# EAGLE design mapleCUx_large_350-005 (EAGLE 9.3.0)
MAPLE-CUx Large Version
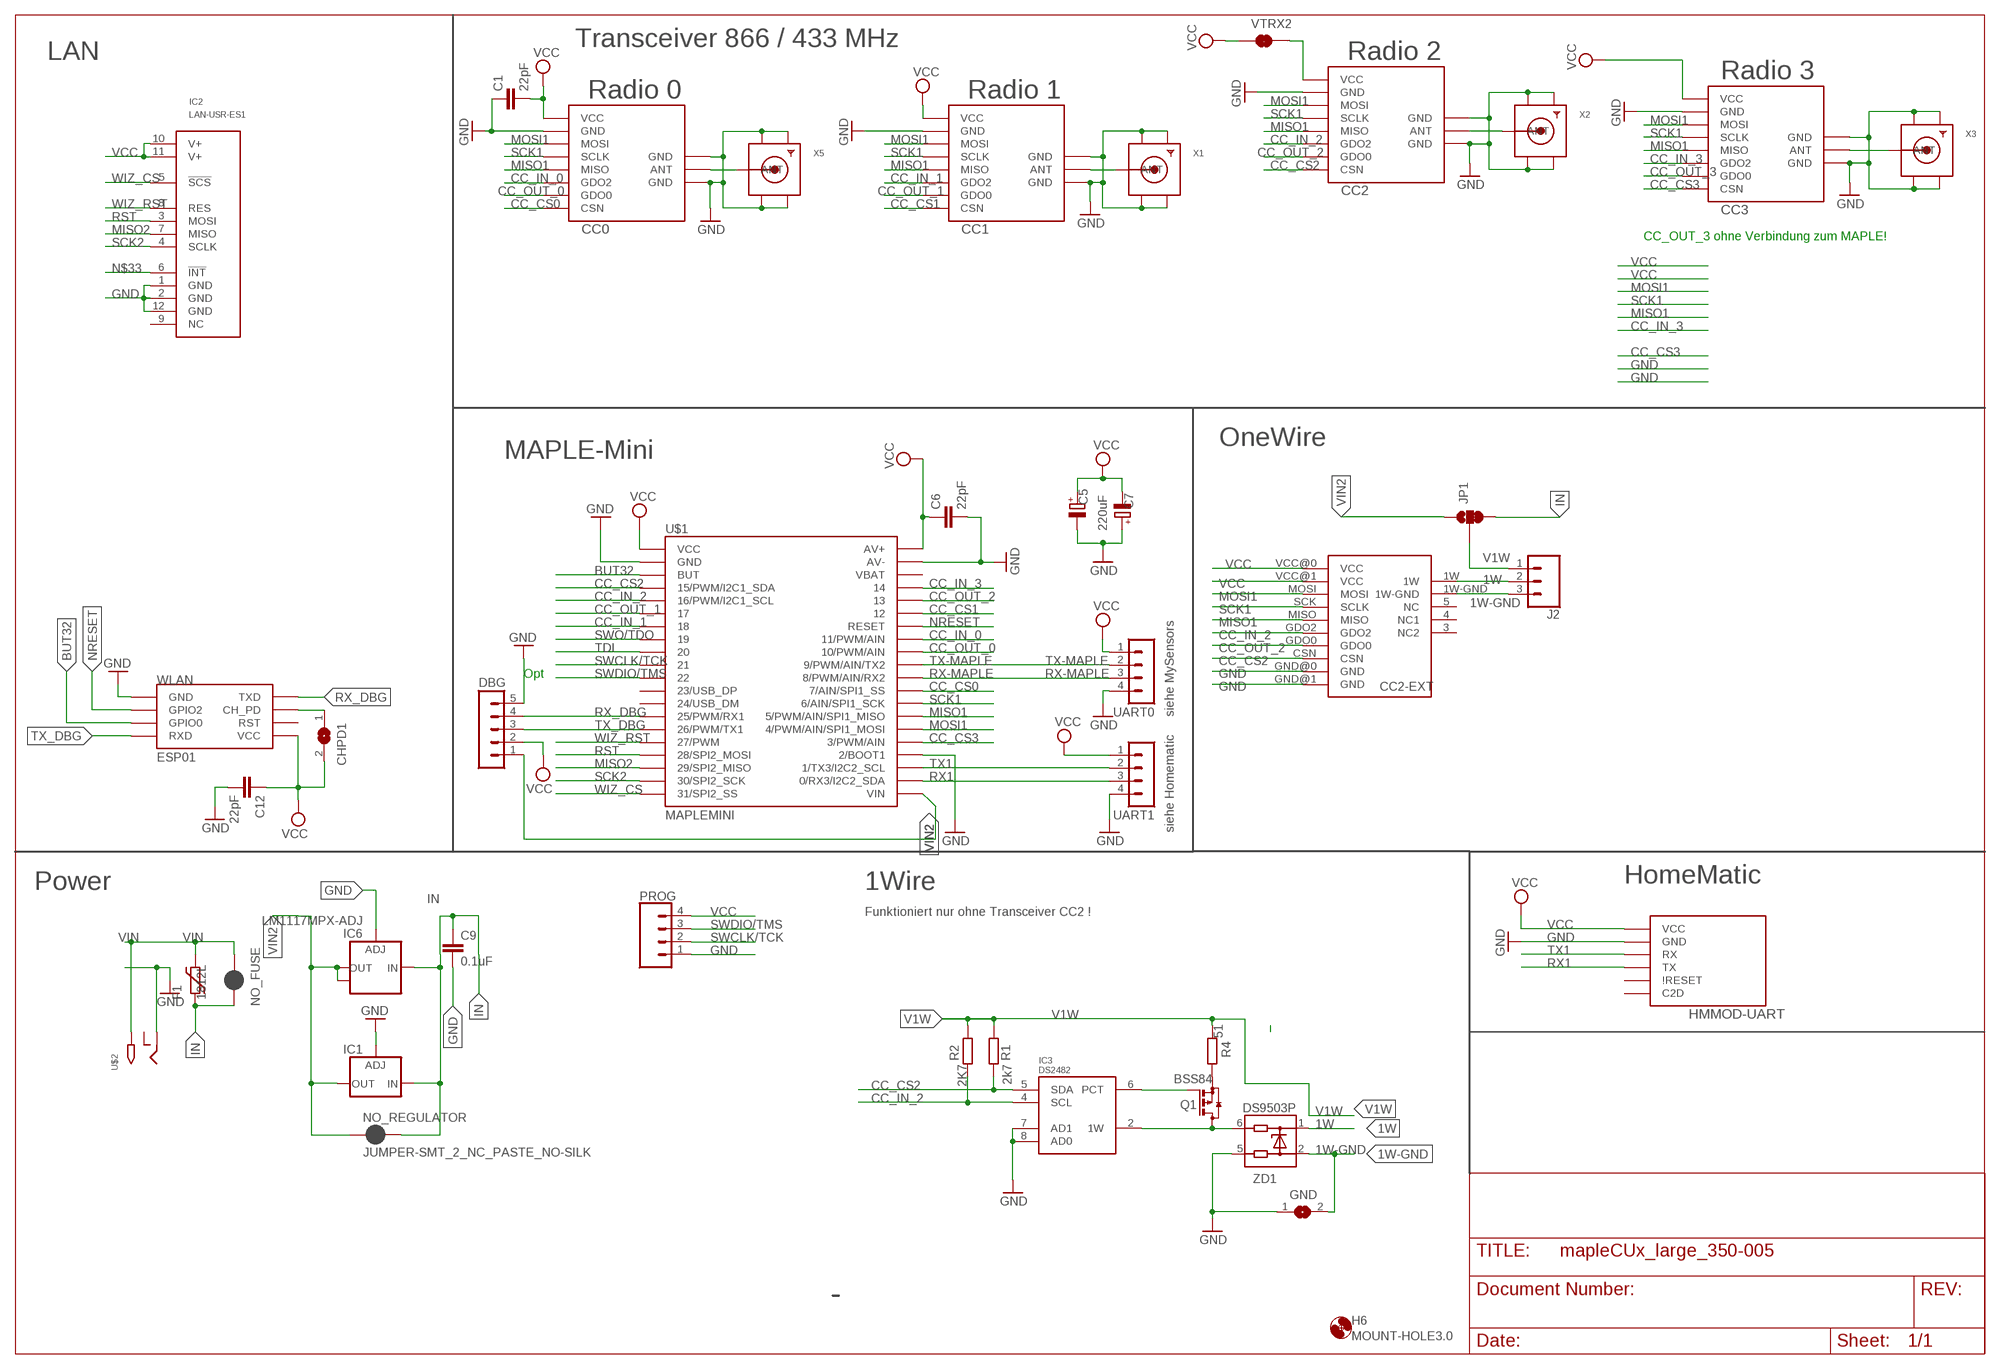
[diagram p0: schematic, sheet 1]

## Parts
C1  22pF  C-EUC0805  [C0805]
C5  220uF  CPOL-EUE5-8.5  [E5-8,5]
C6  22pF  C-EUC0805  [C0805]
C7  CPOL-EUSMCE  [SMC_E]
C9  0.1uF  C-EUC1206  [C1206]
C12  22pF  C-EUC0805  [C0805]
CC0  CC1101  CC1101_MODULE1SMD  [CC1101_MODULE1_SMD]
CC1  CC1101_MODULE1SMD  [CC1101_MODULE1_SMD]
CC2  CC1101_MODULE1SMD  [CC1101_MODULE1_SMD]
CC2-EXT  ONEWIRE-MODULE  [ONEWIRE_CC1101_MODULE3_DIL]
CC3  CC1101_MODULE1SMD  [CC1101_MODULE1_SMD]
CHPD1  SJ  [SJ]
DBG  MA05-1  [MA05-1]
F1  1812L  [1812L]
GND  SJ  [SJ]
H6  MOUNT-HOLE3.0  [3,0]
HMMOD-UART  HM-MOD-UARTDIL  [HM-MOD-UART-DIL]
IC1  LD117ADT50TR  [DPACK]
IC2  LAN-USR-ES1  [USR-ES1]
IC3  DS2482  DS2482-100S  [SO08]
IC6  LM1117MPX-ADJ  [SOT223]
J2  CONN_03LONGPADS  [1X03_LONGPADS]
JP1  JUMPER-SMT_3_1-NC_TRACE_SILK  [SMT-JUMPER_3_1-NC_TRACE_SILK]
NO_FUSE  JUMPER-SMT_2_NC_PASTE_NO-SILK  [SMT-JUMPER_2_NC_PASTE_NO-SILK]
NO_REGULATOR  JUMPER-SMT_2_NC_PASTE_NO-SILK  [SMT-JUMPER_2_NC_PASTE_NO-SILK]
PROG  CONN_04LOCK  [1X04_LOCK]
Q1  BSS84  [SOT23]
R1  2k7  R-EU_R0805  [R0805]
R2  2K7  R-EU_R0805  [R0805]
R4  51  R-EU_R0805  [R0805]
U$1  MAPLEMINI  [20-DIP]
U$2  2.1MMJACKTHM  [PJ-102A]
UART0  MA04-1  [MA04-1]
UART1  MA04-1  [MA04-1]
VTRX2  JUMPER-SMT_2_NC_TRACE_SILK  [SMT-JUMPER_2_NC_TRACE_SILK]
WLAN  ESP01  [ESP01]
X1  SMACONNECTOR_EDGE  [SMA_EDGELAUNCH]
X2  SMACONNECTOR_EDGE  [SMA_EDGELAUNCH]
X3  SMACONNECTOR_EDGE  [SMA_EDGELAUNCH]
X5  SMACONNECTOR_EDGE  [SMA_EDGELAUNCH]
ZD1  DS9503P  [TSOC6]

## Nets
1W: CC2-EXT.1W J2.2 ZD1.1
1W-GND: CC2-EXT.1W-GND GND.2 J2.3 ZD1.2
ANT0: CC0.ANT X5.P(ANT)
ANT1: CC1.ANT X1.P(ANT)
ANT2: CC2.ANT X2.P(ANT)
ANT3: CC3.ANT X3.P(ANT)
BUT32: U$1.3(BUT) WLAN.GPIO0
CC_CS0: CC0.CSN U$1.29(7/AIN/SPI1_SS)
CC_CS1: CC1.CSN U$1.35
CC_CS2: CC2-EXT.CSN CC2.CSN IC3.5(SDA) R1.2 U$1.4(15/PWM/I2C1_SDA)
CC_CS3: CC3.CSN U$1.25(3/PWM/AIN)
CC_IN_0: CC0.GDO2 U$1.33(11/PWM/AIN)
CC_IN_1: CC1.GDO2 U$1.7
CC_IN_2: CC2-EXT.GDO2 CC2.GDO2 IC3.4(SCL) R2.2 U$1.5(16/PWM/I2C1_SCL)
CC_IN_3: CC3.GDO2 U$1.37
CC_OUT_0: CC0.GDO0 U$1.32(10/PWM/AIN)
CC_OUT_1: CC1.GDO0 U$1.6
CC_OUT_2: CC2-EXT.GDO0 CC2.GDO0 U$1.36
CC_OUT_3: CC3.GDO0
GND [Power]: C1.1 C5.- C6.2 C7.+ C9.2 C12.2 CC0.GND@0(GND) CC0.GND@1(GND) CC0.GND@2(GND) CC1.GND@0(GND) CC1.GND@1(GND) CC1.GND@2(GND) CC2-EXT.GND@0(GND) CC2-EXT.GND@1(GND) CC2.GND@0(GND) CC2.GND@1(GND) CC2.GND@2(GND) CC3.GND@0(GND) CC3.GND@1(GND) CC3.GND@2(GND) DBG.5 GND.1 HMMOD-UART.2(GND) IC1.1(ADJ) IC2.1(GND) IC2.2(GND) IC2.12(GND) IC3.7(AD1) IC3.8(AD0) IC6.1(ADJ) PROG.1 U$1.2(GND) U$1.24(2/BOOT1) U$1.39(AV-) U$2.RING UART0.4 UART1.4 WLAN.GND X1.GND@1(GND4) X1.GND@2(GND3) X1.GND@3(GND2) X1.GND@4(GND1) X2.GND@1(GND4) X2.GND@2(GND3) X2.GND@3(GND2) X2.GND@4(GND1) X3.GND@1(GND4) X3.GND@2(GND3) X3.GND@3(GND2) X3.GND@4(GND1) X5.GND@1(GND4) X5.GND@2(GND3) X5.GND@3(GND2) X5.GND@4(GND1) ZD1.5
IN [Power]: C9.1 F1.P$1 IC1.3(IN) IC6.3(IN) JP1.3 NO_FUSE.1 NO_REGULATOR.2
MISO1: CC0.MISO CC1.MISO CC2-EXT.MISO CC2.MISO CC3.MISO U$1.27(5/PWM/AIN/SPI1_MISO)
MISO2: IC2.7(MISO) U$1.18(29/SPI2_MISO)
MOSI1: CC0.MOSI CC1.MOSI CC2-EXT.MOSI CC2.MOSI CC3.MOSI U$1.26(4/PWM/AIN/SPI1_MOSI)
N$1 [Power]: CC2.VCC VTRX2.2
N$2: CHPD1.1 WLAN.CH_PD
N$33: IC2.6(!INT!)
N$47: IC3.6(PCT) Q1.1(G)
N$48: IC3.2(1W) Q1.3(D) ZD1.6
N$52: Q1.2(S) R4.1
NRESET: U$1.34(RESET) WLAN.GPIO2
RST: IC2.3(MOSI) U$1.17(28/SPI2_MOSI)
RX1: HMMOD-UART.5(TX) U$1.22(0/RX3/I2C2_SDA) UART1.3
RX-MAPLE: U$1.30(8/PWM/AIN/RX2) UART0.3
RX_DBG: DBG.4 U$1.14(25/PWM/RX1) WLAN.TX(TXD)
SCK1: CC0.SCLK CC1.SCLK CC2-EXT.SCK(SCLK) CC2.SCLK CC3.SCLK U$1.28(6/AIN/SPI1_SCK)
SCK2: IC2.4(SCLK) U$1.19(30/SPI2_SCK)
SWCLK/TCK: PROG.2 U$1.10
SWDIO/TMS: PROG.3 U$1.11
SWO/TDO: U$1.8
TDI: U$1.9
TX1: HMMOD-UART.6(RX) U$1.23(1/TX3/I2C2_SCL) UART1.2
TX-MAPLE: U$1.31(9/PWM/AIN/TX2) UART0.2
TX_DBG: DBG.3 U$1.15(26/PWM/TX1) WLAN.RX(RXD)
V1W [Power]: J2.1 JP1.2 R1.1 R2.1 R4.2
VCC [Power]: C1.2 C5.+ C6.1 C7.- C12.1 CC0.VCC CC1.VCC CC2-EXT.VCC@0(VCC) CC2-EXT.VCC@1(VCC) CC3.VCC CHPD1.2 DBG.2 HMMOD-UART.1(VCC) IC2.10(V+) IC2.11(V+) PROG.4 U$1.1(VCC) U$1.40(AV+) UART0.1 UART1.1 VTRX2.1 WLAN.VCC
VIN [Power]: F1.P$2 NO_FUSE.2 U$2.TIP
VIN2 [Power]: DBG.1 IC1.4(OUT) IC6.2(OUT) IC6.TAB(OUT1) JP1.1 NO_REGULATOR.1 U$1.21(VIN)
WIZ_CS: IC2.5(!SCS!) U$1.20(31/SPI2_SS)
WIZ_RST: IC2.8(RES) U$1.16(27/PWM)
Unconnected: CC2-EXT.3(NC2) CC2-EXT.4(NC1) CC2-EXT.5(NC) HMMOD-UART.3(C2D) HMMOD-UART.4(\!RESET) IC2.9(NC) U$1.12(23/USB_DP) U$1.13(24/USB_DM) U$1.38(VBAT) U$2.RING_SW WLAN.RST

## Notes on the sheet
- Transceiver 866 / 433 MHz
- LAN | Radio 2
- Radio 3
- Radio 0 | Radio 1
- CC_OUT_3 ohne Verbindung zum MAPLE!
- OneWire
- MAPLE-Mini
- Opt
- siehe MySensors
- siehe Homematic
- Power | 1Wire | HomeMatic
- Funktioniert nur ohne Transceiver CC2 !

## Power pins joined to a net without a drawn wire
GND: IC3.3(GND)
V1W: IC3.1(VDD)

## Library data of the parts
C1 C6 C9 C12 = rcl:C-EU: CAPACITOR, European symbol
C5 = rcl:CPOL-EU: POLARIZED CAPACITOR, European symbol
C7 = rcl:CPOL-EU: POLARIZED CAPACITOR, European symbol; SPICEPREFIX: C
CC0 CC1-CC3 = wireless:CC1101_MODULE1: CC1101 wireless module for 433/868 MHz (sold from Aliexpress). DIL version for mounting with pin header (and SMD soldering) and SMD only variant available.
CC2-EXT = CC1101:ONEWIRE-MODULE
CHPD1 GND = jumper:SJ: SMD solder JUMPER
DBG = con-lstb:MA05-1: PIN HEADER; OC_FARNELL: unknown; OC_NEWARK: unknown
F1 = ptc-littlefuse:1812L
H6 = holes:MOUNT-HOLE: MOUNTING HOLE with drill center marker
HMMOD-UART = wireless:HM-MOD-UART: eQ3 HM-MOD-UART-AW-SH2 wireless module for 868 MHz. DIL version for mounting with pin header (antenna upwards) and SMD variant available (antenna downwards).
IC1 = v-reg:LD117A?*: Low drop fixed and adjustable positive voltage regulators 1 A Source: http://www.st.com/stonline/products/literature/ds/7194/ld1117axx.pdf
IC2 = Martin-Communication:LAN-USR-ES1
IC3 = 1wire:DS2482-100: I2C to 1-Wire Host Adapter/Line Driver This device is a onewire host and I2C interface in one chip. It provides the complete DC/AC requirements for onewire communication, including overdrive speed mode, but, unlike the DS2480B chip, no 12V EPROM programming. Notes: For overdrive speed and 5V EEPROM programming, an external active pullup circuit must be connected to the 1W, VDD and PCT pin. See the datasheet for details. The lower two I2C adress bits of the chip can be selected by external pins, so up to 4 chips may be connected to the same I2C bus. Author: Orginal device and description from Giovanni Varasano <giovanni.varasano@fastwebnet.it> Improved by Jan Kandziora <jjj@gmx.de>
IC6 = lm1117:LM1117MPX-ADJ
J2 = SparkFun-Connectors:CONN_03: Multi connection point. Often used as Generic Header-pin footprint for 0.1 inch spaced/style header connections On any of the 0.1 inch spaced packages, you can populate with these: Break Away Headers - Straight <https://www.sparkfun.com/products/116> (PRT-00116) Break Away Male Headers - Right Angle <https://www.sparkfun.com/products/553> (PRT-00553) Female Headers <https://www.sparkfun.com/products/115> (PRT-00115) Break Away Headers - Machine Pin <https://www.sparkfun.com/products/117> (PRT-00117) Break Away Female Headers - Swiss Machine Pin <https://www.sparkfun.com/products/743> (PRT-00743) Stackable Header - 3 Pin (Female, 0.1") <https://www.sparkfun.com/products/13875> (PRT-13875) For SCREWTERMINALS and SPRING TERMINALS visit here: Screw Terimnals on SparkFun.com <https://www.sparkfun.com/search/results?term=Screw+Terminals> (5mm/3.5mm/2.54mm spacing) This device is also useful as a general connection point to wire up your design to another part of your project. Our various solder wires solder well into these plated through hole pads. Hook-Up Wire - Assortment (Stranded, 22 AWG) <https://www.sparkfun.com/products/11375> (PRT-11375) Hook-Up Wire - Assortment (Solid Core, 22 AWG) <https://www.sparkfun.com/products/11367> (PRT-11367) View the entire wire category on our website here <https://www.sparkfun.com/categories/141> Special notes: Molex polarized connector foot print use with SKU : PRT-08232 with associated crimp pins and housings.
JP1 = SparkFun-Jumpers:JUMPER-SMT_3_1-NC_TRACE: Normally closed trace jumper (1 of 2 connections) This jumper has a trace between two pads so it's normally closed (NC). The other connection is normally open (NO). Use a razor knife to open the connection. For best results follow the IPC guidelines for cutting traces: Cutout at least 0.063 mm (0.005 in). Remove all loose material to clean up the cut area. Seal the cut with an approved epoxy. Reapply solder to reclose the connection, or to close the NO connection.
NO_FUSE NO_REGULATOR = SparkFun-Jumpers:JUMPER-SMT_2_NC_PASTE: Normally closed solder jumper This jumper has an aperture in the stencil to allow solder paste to bridge the split in the wire so it's normally closed (NC). Wick off the solder to open the connection. Reapply solder to reclose the connection.
PROG = SparkFun-Connectors:CONN_04: Multi connection point. Often used as Generic Header-pin footprint for 0.1 inch spaced/style header connections On any of the 0.1 inch spaced packages, you can populate with these: Break Away Headers - Straight <https://www.sparkfun.com/products/116> (PRT-00116) Break Away Male Headers - Right Angle <https://www.sparkfun.com/products/553> (PRT-00553) Female Headers <https://www.sparkfun.com/products/115> (PRT-00115) Break Away Headers - Machine Pin <https://www.sparkfun.com/products/117> (PRT-00117) Break Away Female Headers - Swiss Machine Pin <https://www.sparkfun.com/products/743> (PRT-00743) For SCREWTERMINALS and SPRING TERMINALS visit here: Screw Terimnals on SparkFun.com <https://www.sparkfun.com/search/results?term=Screw+Terminals> (5mm/3.5mm/2.54mm spacing) This device is also useful as a general connection point to wire up your design to another part of your project. Our various solder wires solder well into these plated through hole pads. Hook-Up Wire - Assortment (Stranded, 22 AWG) <https://www.sparkfun.com/products/11375> (PRT-11375) Hook-Up Wire - Assortment (Solid Core, 22 AWG) <https://www.sparkfun.com/products/11367> (PRT-11367) View the entire wire category on our website here <https://www.sparkfun.com/categories/141> Special notes: Molex polarized connector foot print use with SKU : PRT-08231 with associated crimp pins and housings. 1MM SMD Version SKU: PRT-10208; PROD_ID: CONN-09696
Q1 = transistor-small-signal:BSS84: P-CHANNEL MOS FET
R1 R2 R4 = rcl:R-EU_: RESISTOR, European symbol
U$1 = maplemini-small:MAPLEMINI
U$2 = adafruit:2.1MMJACK: 2.1mm x 5.5mm THM DC jack with internal switch. Digikey part #PJ-102A, 4UCON part #05537 2.1mm x 5.5mm SMT DC jack with internal switch. Digikey part #PJ-002A-SMT, 4UCON part #03267 By microbuilder.eu & adafruit.com
UART0 UART1 = con-lstb:MA04-1: PIN HEADER; OC_FARNELL: unknown; OC_NEWARK: unknown
VTRX2 = SparkFun-Jumpers:JUMPER-SMT_2_NC_TRACE: Normally closed trace jumper This jumper has a trace between two pads so it's normally closed (NC). Use a razor knife to open the connection. For best results follow the IPC guidelines for cutting traces: Cutout at least 0.063 mm (0.005 in). Remove all loose material to clean up the cut area. Seal the cut with an approved epoxy. Reapply solder to reclose the connection.
WLAN = esp8266modules:ESP01: ESP8266 Wifi module 01
X1-X3 X5 = adafruit:SMACONNECTOR: SMA Connector 90° DIP SMA Connector, 50 Ohm (4UConnector: 07259)
ZD1 = 1wire:DS9503: ESD Protection Diode with Resistors This ESD protection diode is designed especially for onewire host interfaces. Unlike the DS9502, it has two additional 5Ohm resitors in the 1W and GND line. Pin 5 and 6 have to be connected to the host side, pin 1 und 2 to the network side. The 1W line is through pin 1 and 6, the GND line is through pin 2 and 5. Author: Jan Kandziora <jjj@gmx.de>

## Net classes
0 default: width 0.305 mm
1 Power: width 0.61 mm

## Board
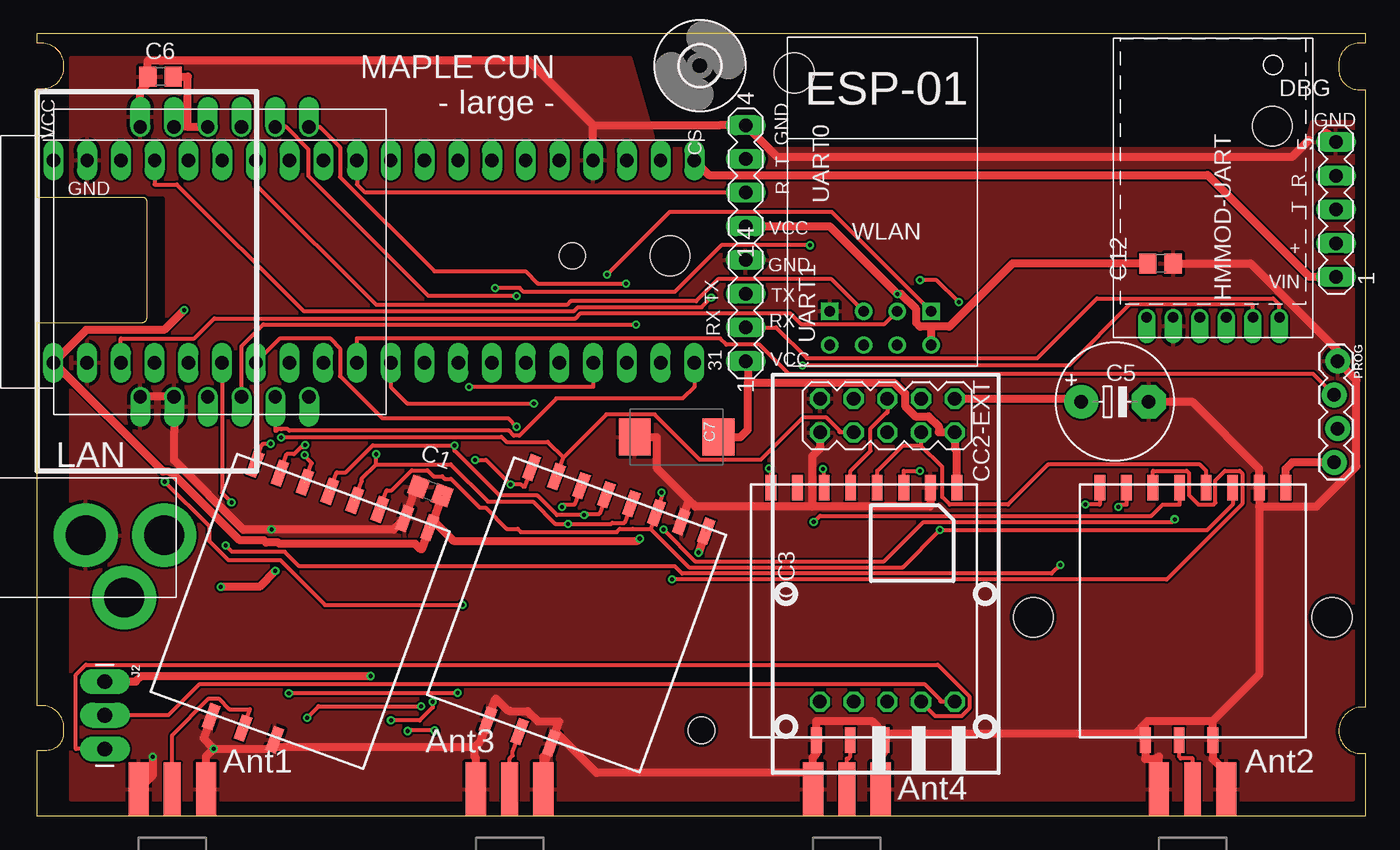
[diagram p1: board, top side]
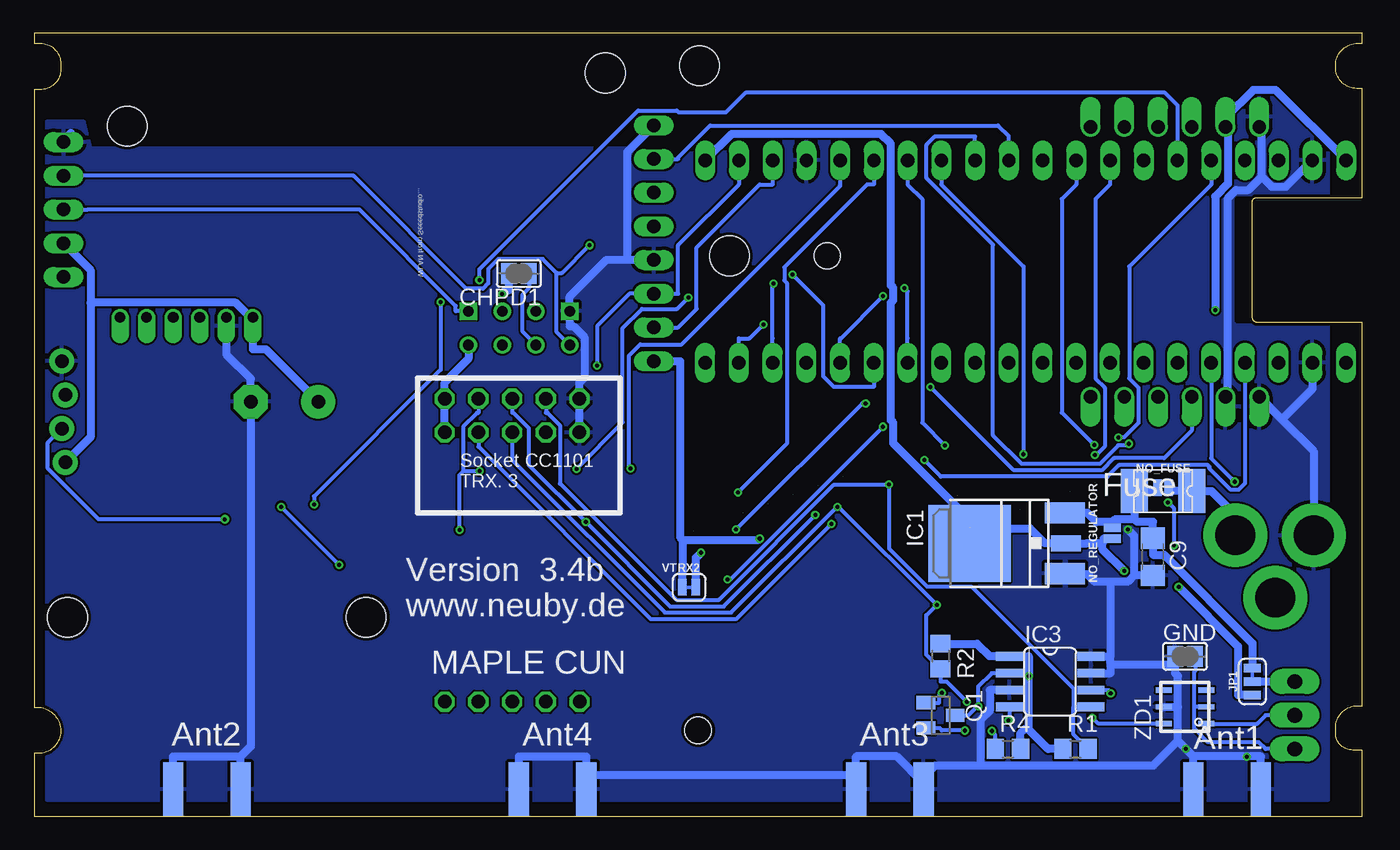
[diagram p2: board, bottom side, seen from below]

Size 100 x 59 mm. Coordinates in mm from the lower left corner, seen from the top.
Outline: 0,0 0,5 0.71,5 arc90 2,6.29 2,6.67 arc90 0.32,8.35 0,8.35 0,37.21 7.89,37.21 arc90 8.26,37.58 8.26,46.32 arc90 7.97,46.61 0,46.61 0,54.83 0.39,54.83 arc90 2,56.44 2,56.57 arc90 0.33,58.24 0,58.24 0,59 100,59 100,58.24 99.54,58.24 arc90 98,56.7 98,56.41 arc90 99.41,54.75 100,54.75 100,8.24 99.8,8.24 arc90 98,6.44 arc90 99.69,4.75 100,4.75 100,0 0,0
Copper layers (1*16): Top 0.035mm / dielectric 1.5mm / Bottom 0.035mm
Design rules "SeeedStudio_2layer_DRU_no_angle_20140221": minimum track width 6mil, minimum drill 12mil, track to track 6mil, track to pad 6mil, pad to pad 6mil, via to via 6mil, smd to smd 0mil, copper to edge 10mil, drill to drill 10mil, minimum pad ring 10mil, minimum via ring 6mil, stop-mask expansion 2mil, vias tented up to drill 100mil, thermal gap 10mil
Holes 2 mm at 50,6.5 40.28,42.23
Holes 3 mm at 47.65,42.23 93,52 57,56 75,15 97.5,15
tRestrict: area 0,37.3 to 9.4,46.5
bRestrict: area 0,37.3 to 9.4,46.5

### Footprints (pad centres in the part's own frame; a part is rotated, then mirrored left to right if it is on the bottom)
C0805 = smd 1.3 x 1.5: 1 -0.95,0; 2 0.95,0
E5-8,5 = drill 1.016 pad 2.54: + -2.54,0 | drill 1.016 pad 2.54 octagon: - 2.54,0
SMC_E = smd 2.4 x 2.8: + -3.15,0; - 3.15,0
C1206 = smd 1.6 x 1.8: 1 -1.4,0; 2 1.4,0
CC1101_MODULE1_SMD = smd 1.93 x 0.813: ANT 19,5.96; CSN 0,0; GDO0 0,2; GDO2 0,4; GND@0 0,12; GND@1 19,8.5; GND@2 19,3.42; MISO 0,6; MOSI 0,10; SCLK 0,8; VCC 0,14
ONEWIRE_CC1101_MODULE3_DIL = drill 1.016 octagon: 1W 24.638,13.716; 1W-GND 24.638,11.176; 3 24.638,8.636; 4 24.638,6.096; 5 24.638,3.556; CSN 1.81,6.1; GDO0 4.35,6.1; GDO2 4.35,8.64; GND@0 1.81,3.56; GND@1 4.35,3.56; MISO 1.81,8.64; MOSI 1.81,11.18; SCK 4.35,11.18; VCC@0 1.81,13.72; VCC@1 4.35,13.72
SJ = smd 1.168 x 1.6: 1 -0.762,0; 2 0.762,0
MA05-1 = drill 1.016 long: 1 -5.08,0; 2 -2.54,0; 3 0,0; 4 2.54,0; 5 5.08,0
1812L = smd 2.03 x 3.3: P$1 -2.16,0; P$2 2.16,0
3,0 = hole 3: 0,0
HM-MOD-UART-DIL = drill 0.8 offset: 1 0,12; 2 0,10; 3 0,8; 4 0,6; 5 0,4; 6 0,2
DPACK = smd 1.6 x 3: 1 -2.28,-4.8; 3 2.28,-4.8 | smd 5.8 x 6.2: 4 0,2.38
USR-ES1 = drill 1 pad 1.35 offset: 1 -10.16,5.715; 2 -10.16,3.175; 3 -10.16,0.635; 4 -10.16,-1.905; 5 -10.16,-4.445; 6 -10.16,-6.985; 7 10.16,-6.985; 8 10.16,-4.445; 9 10.16,-1.905; 10 10.16,0.635; 11 10.16,3.175; 12 10.16,5.715
SO08 = smd 0.66 x 2.032: 1 -1.905,-3.073; 2 -0.635,-3.073; 3 0.635,-3.073; 4 1.905,-3.073; 5 1.905,3.073; 6 0.635,3.073; 7 -0.635,3.073; 8 -1.905,3.073
SOT223 = smd 1.219 x 2.235: 1 -2.311,-3.099; 2 0,-3.099; 3 2.311,-3.099 | smd 3.6 x 2.2: TAB 0,3.099
1X03_LONGPADS = drill 1.118 pad 1.88 long: 1 0,0; 2 2.54,0; 3 5.08,0
SMT-JUMPER_3_1-NC_TRACE_SILK = smd 0.635 x 1.27: 1 -1.016,0; 2 0,0; 3 1.016,0
SMT-JUMPER_2_NC_PASTE_NO-SILK = smd 0.635 x 1.27: 1 -0.406,0; 2 0.406,0
1X04_LOCK = drill 1.016 pad 1.88: 1 0,0.127; 2 2.54,-0.127; 3 5.08,0.127; 4 7.62,-0.127
SOT23 = smd 1 x 1.4: 1 -0.95,-1.1; 2 0.95,-1.1; 3 0,1.1
R0805 = smd 1.3 x 1.5: 1 -0.95,0; 2 0.95,0
20-DIP = drill 1.016 pad 1.27 long: 1 -24.13,-7.62; 2 -21.59,-7.62; 3 -19.05,-7.62; 4 -16.51,-7.62; 5 -13.97,-7.62; 6 -11.43,-7.62; 7 -8.89,-7.62; 8 -6.35,-7.62; 9 -3.81,-7.62; 10 -1.27,-7.62; 11 1.27,-7.62; 12 3.81,-7.62; 13 6.35,-7.62; 14 8.89,-7.62; 15 11.43,-7.62; 16 13.97,-7.62; 17 16.51,-7.62; 18 19.05,-7.62; 19 21.59,-7.62; 20 24.13,-7.62 | drill 1 pad 1.27 long: 21 24.13,7.62; 22 21.59,7.62; 23 19.05,7.62; 24 16.51,7.62; 25 13.97,7.62; 26 11.43,7.62; 27 8.89,7.62; 28 6.35,7.62; 29 3.81,7.62; 30 1.27,7.62; 31 -1.27,7.62; 32 -3.81,7.62; 33 -6.35,7.62; 34 -8.89,7.62; 35 -11.43,7.62; 36 -13.97,7.62; 37 -16.51,7.62; 38 -19.05,7.62; 39 -21.59,7.62; 40 -24.13,7.62
PJ-102A = drill 3 pad 4.8: RING 0.1,-3.39; RING_SW -4.6,-6.29; TIP 0.1,-9.29
MA04-1 = drill 1.016 long: 1 -3.81,0; 2 -1.27,0; 3 1.27,0; 4 3.81,0
SMT-JUMPER_2_NC_TRACE_SILK = smd 0.635 x 1.27: 1 -0.508,0; 2 0.508,0
ESP01 = drill 0.8: CH_PD -1.285,-8.178; GPIO0 1.255,-5.638; GPIO2 -1.285,-5.638; RST 1.255,-8.178; TX -3.825,-8.178; VCC 3.795,-8.178 | drill 0.8 square: GND -3.825,-5.638; RX 3.795,-5.638
SMA_EDGELAUNCH = smd 4.064 x 1.524: GND@1 2.032,-2.54; GND@2 2.032,2.54 | smd 4.064 x 1.524 bottom: GND@3 2.032,2.54; GND@4 2.032,-2.54 | smd 4.064 x 1.27: P 2.032,0
TSOC6 = smd 0.406 x 1.219: 1 -1.27,-1.6; 2 0,-1.6; 3 1.27,-1.6; 4 1.27,1.6; 5 0,1.6; 6 -1.27,1.6

### Placement (x,y rotation side)
C1  29.59,24.51 340 top
C5  81.15,31.24 0 top
C6  9.27,55.74 180 top
C7  48.13,28.57 0 top
C9  15.75,19.56 270 bottom
C12  84.58,41.66 0 top
CC0  16.38,26.54 250 top
CC1  80.01,24.77 270 top
CC2  37.21,26.29 250 top
CC2-EXT  55.37,33.27 270 top
CC3  55.24,24.77 270 top
CHPD1  63.5,40.89 180 bottom
DBG  97.79,45.72 90 top
F1  14.99,24.51 0 bottom
GND  13.34,12.06 0 bottom
H6  49.89,56.55 0 top
HMMOD-UART  95.54,37.59 90 top
IC1  27.18,20.57 90 bottom
IC2  13.46,41.78 90 top
IC3  23.5,10.16 270 bottom
IC6  25.4,20.57 90 bottom
J2  5.08,10.16 270 top
JP1  8.26,10.16 90 bottom
NO_FUSE  14.99,24.77 0 bottom
NO_REGULATOR  18.8,21.34 90 bottom
PROG  97.79,34.29 270 top
Q1  31.75,7.62 270 bottom
R1  21.59,5.08 0 bottom
R2  31.75,12.06 270 bottom
R4  26.67,5.08 0 bottom
U$1  25.34,41.8 0 top
U$2  0.25,21.08 90 top
UART0  53.34,48.26 90 top
UART1  53.34,38.1 90 top
VTRX2  50.67,17.27 0 bottom
WLAN  63.5,43.69 0 top
X1  87,0 90 top
X2  35.56,0 90 top
X3  60.96,0 90 top
X5  10.16,0 90 top
ZD1  13.34,8.26 90 bottom

### Tracks (layer width: path | path; a pad name or v marks a point on that pad's centre or on a via)
1W
  Top 0.305: J2.2 9.86,7.62 12.18,9.94 66.85,9.94 68.02,8.77 68.02,8.64 CC2-EXT.1W
  Bottom 0.305: J2.2 7.26,7.62 7.9,6.99 ZD1.1
1W-GND
  Top 0.305: J2.3 2.9,5.08 2.9,10.68 3.65,11.43 67.81,11.43 70.17,9.06 70.17,8.14 69.59,7.56 67.62,7.56 CC2-EXT.1W-GND
  Bottom 0.305: GND.2 12.57,10.96 12.65,10.88 12.65,8.26 | 12.65,8.26 12.65,6.63 11.62,5.6 7.78,5.6 7.26,5.08 J2.3 | ZD1.2 12.65,8.26
ANT0  (1 unrouted)
  Top 0.305: CC0.ANT 16.01,8.09 14.45,8.09 13.65,8.88 12.91,8.88 10.16,6.13 X5.P
ANT1
  Top 0.305: X1.P 87,4.37 86.1,4.37 85.97,4.5 CC1.ANT
ANT2  (1 unrouted)
  Top 0.305: CC2.ANT 35.79,4.96 | X2.P 35.56,4.37 35.79,4.6 35.79,4.96 | 35.79,4.96
ANT3
  Top 0.305: X3.P 60.96,4.37 61.08,4.37 61.2,4.5 CC3.ANT
BUT32
  Top 0.305: WLAN.GPIO0 63.8,37.09 57.5,37.09 56.69,37.91 40.91,37.91 40.52,37.51 13.32,37.51 11.81,36.01 6.29,36.01 U$1.3
CC_CS0  (via drill 0.3 pad 0.61)
  Top 0.305: 16.91,27.98 | 16.91,27.98 17,28.07 v17.55,28.07 | CC0.CSN 16.91,27.98
  Bottom 0.305: v17.55,28.07 17.68,27.95 18.37,27.95 19.76,26.56 25.64,26.56 27.79,28.71 27.79,43.06 32.81,48.08 32.81,50.59 32.17,51.23 29.15,51.23 U$1.29
CC_CS1  (via drill 0.3 pad 0.61)
  Top 0.305: v78.93,23.5 80.01,23.5 CC1.CSN | v69.39,38.73 67.72,40.4 v66.47,40.4
  Bottom 0.305: v69.39,38.73 69.39,33.66 78.93,24.12 v78.93,23.5 | v66.47,40.4 66.47,41.23 54.52,53.18 51.6,53.18 51.46,53.04 47.91,53.04 46.39,54.55 14.9,54.55 13.91,53.56 U$1.35
CC_CS2  (via drill 0.3 pad 0.61)
  Top 0.305: v32.97,26.85 33.78,26.85 v35.63,25.01 36.44,25.01 36.59,24.85 36.69,24.85 CC2.CSN
  Bottom 0.305: U$1.4 8.83,25.09 9.32,24.6 9.88,24.6 11.5,26.22 11.5,26.34 11.62,26.47 18.31,26.47 19.17,25.61 31.73,25.61 v32.97,26.85 | 21.74,8.26 21.74,9.64 29.43,17.32 32.77,17.32 35.63,20.19 v35.63,25.01 39.76,25.01 48.44,16.32 51.65,16.32 60.41,25.08 60.41,29.46 61.34,30.4 61.47,30.4 CC2-EXT.CSN | R1.2 21.74,6.18 21.74,8.26 | IC3.5 21.74,8.26
CC_CS3  (via drill 0.3 pad 0.61)
  Top 0.305: v55.08,26.2 55.24,26.04 CC3.CSN
  Bottom 0.305: v55.08,26.2 55.19,26.32 55.19,34.73 54.36,35.56 51.24,35.56 39.31,47.49 39.31,47.61 U$1.25
CC_IN_0  (via drill 0.3 pad 0.61)  (1 unrouted)
  Top 0.305: 20.66,26.61 | 20.66,26.61 20.11,27.16 v20.11,27.21 | CC0.GDO2 20.66,26.61
  Bottom 0.305: v20.11,27.21 20.03,27.21 19.38,27.87 19.38,32.3 20.08,33 20.08,46.52 18.99,47.61 U$1.33
CC_IN_1  (via drill 0.3 pad 0.61)
  Top 0.305: v47.78,17.85 85.05,17.85 90.73,23.53 90.73,25.84 90.54,26.04 89.43,26.04 88.72,25.32 88.72,23.64 88.57,23.5 87.43,23.5 86.72,24.21 86.72,25.86 86.54,26.04 84.01,26.04 CC1.GDO2 | U$1.7 18.29,36.02 22.03,36.02 22.8,35.26 22.8,33.17 25.97,30 35.43,30 v36.07,29.35
  Bottom 0.305: v36.07,29.35 47.58,17.85 v47.78,17.85
CC_IN_2  (via drill 0.3 pad 0.61)  (1 unrouted)
  Top 0.305: v9.6,25.21 12.93,21.89 12.93,20.77 14.38,19.32 18.28,19.32 21.66,15.94 v32.03,15.94 | v29.77,8.62 29.77,8.21 28.79,7.23 v26.62,7.23 | CC2.GDO2 40.45,23.48 39.66,23.48 v39.5,23.32
  Bottom 0.305: CC2-EXT.GDO2 64.01,26.86 52.51,15.36 47.52,15.36 39.56,23.32 v39.5,23.32 39.42,23.32 v32.03,15.94 32.81,15.15 32.81,12.18 R2.2 31.75,10.16 31.3,10.16 v29.77,8.62 | U$1.5 11.37,26.98 v9.6,25.21 | IC3.4 26.57,7.28 v26.62,7.23
CC_IN_3  (via drill 0.3 pad 0.61)
  Top 0.305: v50.74,39.09 50.01,38.36 40.72,38.36 40.43,38.07 20.04,38.07 10.51,47.61 8.83,47.61 U$1.37 | CC3.GDO2 59.24,26.04 59.17,26.11 v59.17,26.19
  Bottom 0.305: v59.17,26.19 55.68,29.68 55.68,36.8 54.24,38.23 51.6,38.23 v50.74,39.09
CC_OUT_0  (via drill 0.3 pad 0.61)  (1 unrouted)
  Top 0.305: v20.17,27.98 20.02,27.82 19.86,27.82 19.33,27.3 18.79,27.3 CC0.GDO0
  Bottom 0.305: v20.17,27.98 22.62,30.42 22.62,46.51 21.53,47.61 U$1.32
CC_OUT_1  (via drill 0.3 pad 0.61)
  Top 0.305: v77.02,18.96 76.37,18.31 48.55,18.31 48.02,18.84 19.73,18.84 18.63,19.93 14.66,19.93 v14.19,20.4 | U$1.6 13.91,24.37 v14.61,23.66 | v81.39,23.33 81.56,23.5 82.01,23.5 CC1.GDO0
  Bottom 0.305: v14.61,23.66 14.19,23.24 v14.19,20.4 | v81.39,23.33 v77.02,18.96
CC_OUT_2  (via drill 0.3 pad 0.61)  (1 unrouted)
  Top 0.305: 39.61,27.04 | 39.61,27.04 42.85,30.28 46.48,30.28 49.89,26.87 54.47,26.87 57.63,30.04 59.43,30.04 60.41,29.06 60.41,28.92 CC2-EXT.GDO0 | v18.37,28.56 18.41,28.59 34.94,28.59 35.31,28.22 38.43,28.22 39.61,27.04 | CC2.GDO0 39.61,27.04
  Bottom 0.305: U$1.36 11.37,47.61 17.54,41.44 17.54,33 16.83,32.29 16.83,29.65 17.93,28.56 v18.37,28.56
GND  (via drill 0.3 pad 0.61)
  Top 0.61: 63.74,6.27 62.83,7.19 58.66,7.19 CC3.GND@2 58.66,5.05 58.66,4.7 58.49,4.52 58.42,4.52 58.42,3.28 | X5.GND@4 12.7,4.52 v13.28,5.11 | v13.28,5.11 | v13.28,5.11 12.5,5.89 | 12.5,5.89 | v13.28,5.11 17.36,5.11 17.78,5.53 | CC0.GND@2 12.5,5.89 | 63.74,6.27 82.71,6.27 83.43,7 | 83.43,7 83.62,7.19 88.51,7.19 | 83.43,7 CC1.GND@2 83.43,4.34 84.28,4.34 84.45,4.52 X1.GND@3 | 92.01,23.34 92.01,10.69 88.51,7.19 | 88.51,7.19 CC1.GND@1 88.51,4.34 89.53,3.32 X1.GND@4 | 92.01,23.34 96.32,23.34 99.34,26.36 99.34,32.87 PROG.1 97.92,35.1 91.36,41.66 C12.2 | 63.74,6.27 CC3.GND@1 63.74,4.77 63.5,4.52 X3.GND@4 | 17.78,5.53 | 32.91,5.21 18.09,5.21 17.78,5.53 | 32.91,5.21 33.33,5.63 | 33.33,5.63 | 32.91,5.21 32.91,4.52 33.02,4.42 X2.GND@3 | CC0.GND@1 17.78,5.53 | 39.01,6.39 39.29,7.16 37.69,7.16 36.93,7.92 35.61,7.92 35.57,7.96 35.46,7.96 34.52,8.9 CC2.GND@2 33.33,5.63 | 39.01,6.39 CC2.GND@1 38.18,4.1 | 58.42,3.28 42.12,3.28 39.01,6.39 | 39.01,6.39 | X3.GND@3 58.42,3.28 | 41.85,52.07 36.97,56.94 8.32,56.94 C6.2 8.32,55.24 7.75,54.66 IC2.12 | U$1.24 41.85,52.07 | 41.85,52.07 51.36,52.07 UART0.4 55.75,49.66 94.47,49.66 95.76,50.96 | v8.7,4.5 8.7,3.11 X5.GND@3 | C5.- 86.96,31.24 92.01,26.19 CC1.GND@0 92.01,23.34 | 38.18,4.1 | 38.18,4.1 38.11,4.17 38.11,4.51 38.1,4.52 X2.GND@1 | IC2.1 IC2.2 10.29,28.9 10.29,26.84 15.51,21.62 v17.62,21.62 26.84,21.62 CC0.GND@0 28.25,24.07 | C7.+ 46.64,28.57 46.64,26.26 49.08,23.82 | 49.08,23.82 | 58.34,23.34 49.56,23.34 49.08,23.82 | 28.25,24.07 | 28.25,24.07 28.25,24.39 C1.1 | 58.34,23.34 67.25,23.34 CC3.GND@0 | 58.34,23.34 58.34,27.12 58.93,27.7 CC2-EXT.GND@1 | CC2.GND@0 49.08,23.82 | 97.09,51.5 DBG.5
  Bottom 0.61: v13.29,5.11 12.7,4.52 | 13.87,5.69 v13.29,5.11 | v13.29,5.11 v13.28,5.11 | 17.16,18.18 17.16,21.15 v17.62,21.62 | 18.84,11.44 18.95,11.33 18.95,10.79 IC3.7 | 14.1,11.44 18.84,11.44 | 18.84,11.44 18.95,11.54 18.95,12.06 | 18.95,17.68 20.14,17.68 20.73,18.26 IC6.1 22.35,18.26 IC1.1 | 17.16,18.18 17.66,17.68 18.95,17.68 | 18.95,17.68 18.95,12.06 | IC3.8 18.95,12.06 | C9.2 17.11,18.16 17.12,18.18 17.16,18.18 | 38.1,3.14 38.1,4.52 35.04,4.52 33.02,2.5 | X2.GND@1 38.1,3.14 | 58.42,3.14 58.42,4.52 63.5,4.52 X3.GND@4 | X3.GND@3 58.42,3.14 | 58.42,3.14 38.1,3.14 | 55.35,41.94 55.32,41.91 UART1.4 | 55.35,41.94 56.89,41.94 59.67,39.16 WLAN.GND 59.67,36.94 59.4,36.94 58.56,36.11 58.56,33.05 58.93,32.68 CC2-EXT.GND@0 CC2-EXT.GND@1 | UART0.4 55.35,50.06 55.35,41.94 | 84.45,4.52 83.69,5.28 83.69,29.52 C5.- 83.69,32.97 85.54,34.81 HMMOD-UART.2 | 28.73,3.85 15.71,3.85 13.87,5.69 | 28.73,3.85 32.14,3.85 33.02,2.97 33.02,2.5 | 28.73,3.85 28.73,7.26 28.04,7.95 28.04,9.53 IC3.3 | 14.1,11.44 14.1,10.81 13.87,10.58 13.87,8.26 | GND.1 14.1,11.44 | 8.7,4.52 12.7,4.52 | 8.7,4.52 7.62,4.52 X5.GND@3 | 8.7,4.52 v8.7,4.5 | X1.GND@3 84.45,4.52 | X1.GND@4 89.53,4.52 84.45,4.52 | X2.GND@3 33.02,2.5 | 13.87,5.69 13.87,8.26 | 7.56,48.18 7.56,51.75 IC2.12 | IC2.2 10.11,31.8 10.11,46.57 9.49,47.18 8.56,47.18 7.56,48.18 | 7.56,48.18 6.8,47.42 5.74,47.42 U$1.39 | 6.03,29.91 3.64,27.52 U$2.RING | 6.03,29.91 IC2.1 | 6.03,29.91 3.75,32.2 U$1.2 | X5.GND@4 12.7,4.52 | ZD1.5 13.87,8.26 | 97.22,51.5 97.79,50.93 DBG.5
  pour Top: 2.54,57.15 44.63,57.15 46.59,50.29 95.5,50.29 96.01,52.32 99.06,52.32 99.06,1.27 2.54,1.27
  pour Bottom: 2.54,1.27 2.54,57.15 44.27,57.15 46.23,50.29 95.76,50.29 96.27,52.32 99.06,52.32 99.06,1.27
IN
  Bottom 0.61: 17.15,22.4 16.96,22.21 15.75,22.21 C9.1 15.75,19.7 14.91,19.7 8.26,13.04 JP1.3 | 18.8,22.18 18.57,22.4 17.15,22.4 | 18.8,22.18 18.8,22.13 NO_REGULATOR.2 | 18.8,22.18 20.02,22.18 20.73,22.89 IC6.3 22.35,22.89 IC1.3 | NO_FUSE.1 15.42,24.77 15.67,24.51 F1.P$1 17.15,22.4
MISO1  (via drill 0.3 pad 0.61)  (2 unrouted)
  Top 0.305: CC1.MISO 86.01,23.5 84.74,23.5 83.89,22.64 58.93,22.64 v58.46,22.17 | CC2.MISO 42.33,22.8 41.41,22.8 41.32,22.71 v41.18,22.71 39.12,22.71 37.65,24.18 34.79,24.18 31.42,27.55 v31.42,27.95 25.25,27.95 23.22,25.93 22.54,25.93 CC0.MISO | CC2-EXT.MISO 64.01,30.4 63.9,30.4 62.74,29.24 62.74,27.53 61.24,26.04 CC3.MISO
  Bottom 0.305: v41.18,22.71 48.07,15.81 52.1,15.81 v58.46,22.17 62.74,26.45 62.74,29.24 63.9,30.4 64.01,30.4 CC2-EXT.MISO | U$1.27 34.23,47.61 33.13,46.51 33.13,29.66 v31.42,27.95
MISO2  (via drill 0.3 pad 0.61)
  Top 0.305: IC2.7 21.27,51.94 22.8,50.41 22.8,48.16 29.89,41.06 36.75,41.06 37.67,40.14 v44.32,40.14
  Bottom 0.305: v44.32,40.14 44.39,40.08 44.39,36.01 U$1.18
MOSI1  (via drill 0.3 pad 0.61)  (2 unrouted)
  Top 0.305: 46.17,21.66 44.82,21.66 43.85,21.66 43.62,21.43 36.4,21.43 36.18,21.66 35.34,21.66 33.73,23.26 33.32,23.26 31.15,25.43 30.67,25.43 30.49,25.61 29.84,25.61 29.38,26.07 28.19,26.07 26.68,24.56 26.3,24.56 CC0.MOSI | v47.01,24.4 47.1,24.31 47.13,24.31 CC2.MOSI 46.17,21.66 | 46.17,21.66 49.06,18.76 65.17,18.76 v67.97,21.57 88.09,21.57 90.01,23.5 CC1.MOSI | v66.46,26.04 65.25,26.04 CC3.MOSI | 46.17,21.66
  Bottom 0.305: v47.01,24.4 43.32,28.09 43.32,40.18 43.52,40.38 43.52,41.37 37.28,47.61 36.77,47.61 U$1.26 | 67.65,26.04 v66.46,26.04 | v67.97,21.57 67.97,25.71 67.65,26.04 | 67.65,26.04 67.65,29.41 66.66,30.4 66.55,30.4 CC2-EXT.MOSI
N$1  (via drill 0.3 pad 0.61)  (1 unrouted)
  Top 0.61: v49.77,19.87 | CC2.VCC v49.77,19.87
  Bottom 0.61: VTRX2.2 50.16,19.48 v49.77,19.87
N$2
  Bottom 0.305: CHPD1.1 62.74,39.79 63.21,39.31 63.21,36.51 WLAN.CH_PD
N$47  (via drill 0.3 pad 0.61)
  Top 0.305: v18.94,9.28 18.97,9.32 v31.65,9.32
  Bottom 0.305: v31.65,9.32 31.84,9.12 31.84,8.57 Q1.1 | IC3.6 19.1,9.53 19.1,9.45 v18.94,9.28
N$48  (via drill 0.3 pad 0.61)
  Top 0.305: v20.31,7.43 21.18,8.3 v28.9,8.3
  Bottom 0.305: ZD1.6 19.86,6.99 v20.31,7.43 | IC3.2 27.89,10.79 28.9,9.79 v28.9,8.3 28.96,8.3 29.64,7.62 Q1.3
N$52  (via drill 0.3 pad 0.61)
  Top 0.305: v29.92,6.47 27.91,6.47 v27.87,6.43
  Bottom 0.305: Q1.2 31.84,6.67 31.64,6.47 v29.92,6.47 | R4.1 27.62,6.13 27.87,6.39 v27.87,6.43
NRESET
  Top 0.305: U$1.34 16.45,47.61 25.53,38.53 39.87,38.53 40.16,38.82 49.61,38.82 51.25,40.47 59.8,40.47 WLAN.GPIO2
RST  (via drill 0.3 pad 0.61)
  Top 0.305: v32.5,32.35 41.85,32.35 U$1.17
  Bottom 0.305: v32.5,32.35 26.21,26.07 19.6,26.07 18.68,26.99 14.89,26.99 12.83,29.06 IC2.3
RX1  (via drill 0.3 pad 0.61)
  Top 0.305: v57.61,33.98 77.66,33.98 82.23,38.55 91.54,38.55 HMMOD-UART.5
  Bottom 0.305: v57.61,33.98 57.61,36.92 55.17,39.37 UART1.3 51.51,39.37 51.51,43.02 46.93,47.61 U$1.22
RX-MAPLE
  Bottom 0.305: U$1.30 26.61,51.23 27.43,52.05 49.1,52.05 51.51,49.64 51.51,49.53 UART0.3
RX_DBG  (via drill 0.3 pad 0.61)
  Top 0.305: v58.18,43.02 51.5,43.02 48,39.52 36.62,39.52 36.32,39.81 v34.47,39.81
  Bottom 0.305: v34.47,39.81 34.23,39.57 34.23,36.01 U$1.14 | 60.65,40.95 60.25,40.95 v58.18,43.02 | 60.65,40.95 61.7,42 65.06,42 65.81,41.25 65.81,40.16 66.2,39.76 67.47,39.76 75.96,48.26 DBG.4 | WLAN.TX 60.65,36.49 60.65,40.95
SCK1  (via drill 0.3 pad 0.61)  (2 unrouted)
  Top 0.305: 25.5,26.52 31.12,26.52 33.92,23.72 37.32,23.72 38.99,22.05 v39.97,22.05 43.22,22.05 43.29,22.12 44.21,22.12 CC2.SCLK | 25.5,26.52 v25.5,27.28 | 24.42,25.24 | 24.42,25.24 24.42,25.45 25.5,26.52 | 66.55,27.92 68.15,26.33 68.15,24.05 68.7,23.5 73.09,23.5 76.1,26.5 87.55,26.5 88.01,26.04 CC1.SCLK | 66.55,27.92 65.13,27.92 63.24,26.04 CC3.SCLK | 66.55,27.92 66.55,28.39 CC2-EXT.SCK | CC0.SCLK 24.42,25.24
  Bottom 0.305: CC2-EXT.SCK 66.55,27.86 53.55,14.86 47.16,14.86 v39.97,22.05 | U$1.28 31.69,47.61 25.5,41.42 v25.5,27.28
SCK2  (via drill 0.3 pad 0.61)
  Top 0.305: IC2.4 15.37,35.42 17,37.06 v45.09,37.06
  Bottom 0.305: v45.09,37.06 46.14,36.01 46.93,36.01 U$1.19
SWCLK/TCK
  Top 0.305: PROG.2 96.08,33.34 56.59,33.34 54.4,35.53 51.88,35.53 51.41,36.01 24.07,36.01 U$1.10
SWDIO/TMS  (via drill 0.3 pad 0.61)
  Top 0.305: v47.14,21.61 49.53,19.22 63.77,19.22 66.73,22.18 85.44,22.18 v85.64,22.39 | U$1.11 26.61,32.35 27.85,31.11 v37.38,31.11
  Bottom 0.305: v85.64,22.39 95.15,22.39 98.97,26.21 98.97,28.16 PROG.3 | v37.38,31.11 37.64,31.11 v47.14,21.61
TX1
  Top 0.305: HMMOD-UART.6 93.54,38.55 93.07,39.02 79.8,39.02 75.3,34.52 57.94,34.52 55.63,36.83 UART1.2
  Bottom 0.305: U$1.23 44.39,47.61 45.37,47.61 50.12,42.85 50.12,38.22 51.51,36.83 UART1.2
TX-MAPLE
  Top 0.305: U$1.31 24.07,47.61 24.68,46.99 UART0.2
TX_DBG  (via drill 0.3 pad 0.61)
  Top 0.305: WLAN.RX 59.82,45.52 47.62,45.52 v42.9,40.81
  Bottom 0.305: U$1.15 36.77,32.35 39.79,32.35 40.58,33.14 40.58,38.48 v42.9,40.81 | DBG.3 95.96,45.72 75.51,45.72 68.25,38.46 68.25,38.05 WLAN.RX
V1W  (via drill 0.3 pad 0.61)
  Top 0.61: v25.09,10.57 7.83,10.57 7.42,10.16 J2.1
  Bottom 0.61: 25.17,6.6 23.65,5.08 R1.1 | 25.17,6.6 25.41,6.6 25.72,6.29 R4.2 | 25.17,6.6 25.09,6.67 v25.09,10.57 25.09,12.06 IC3.1 27.3,12.06 28.04,12.06 28.99,13.02 R2.1 | JP1.2 J2.1
VCC  (via drill 0.3 pad 0.61)  (2 unrouted)
  Top 0.61: UART0.1 59.66,44.45 v64.76,39.35 65.04,39.35 66.18,38.21 66.18,37.19 66.48,36.89 67.3,36.89 | 29.93,22.15 31.32,20.76 45.2,20.76 v45.36,20.92 | 28.42,20.54 28.45,20.54 28.87,20.12 28.95,20.12 CC0.VCC 29.93,22.15 | 28.42,20.54 | 28.42,20.54 18.89,20.54 18.24,20.54 18.16,20.63 17.22,20.63 17.04,20.8 15.23,20.8 10.15,25.89 10.01,25.89 9.92,25.98 9.46,25.98 1.23,34.21 | CC1.VCC 94.01,26.19 94.49,26.67 PROG.4 | 29.93,22.67 | 29.93,22.67 29.93,22.15 | C12.1 73.44,41.66 68.68,36.89 67.3,36.89 | 67.3,36.89 WLAN.VCC | 1.23,34.21 U$1.1 | v11.06,38.15 9.55,36.64 3.67,36.64 1.23,34.21 | 53.51,32.69 64.52,32.69 65.33,31.87 65.33,30.92 66.11,30.14 67.11,30.14 67.87,29.38 67.87,28.92 CC2-EXT.VCC@1 69.09,27.7 69.25,27.55 CC3.VCC | UART1.1 53.51,34.12 53.51,32.69 | 53.51,32.69 53.51,29.14 52.94,28.57 C7.- | C1.2 29.93,22.67 | 11.33,51.94 IC2.11 | CC2-EXT.VCC@0 78.39,31.46 C5.+ | 11.33,51.94 IC2.10 | 11.33,51.94 11.33,55.74 C6.1
  Bottom 0.61: 51.18,20.84 45.44,20.84 v45.36,20.92 | 51.18,20.84 51.18,18.36 VTRX2.1 | 51.18,20.84 51.36,21.02 51.36,34.29 UART1.1 | WLAN.VCC 67.3,34.48 69.09,32.68 CC2-EXT.VCC@0 CC2-EXT.VCC@1 | 95.75,38.7 95.75,28.58 PROG.4 | DBG.2 95.75,41.14 95.75,38.7 | 83.54,37.42 84.82,38.7 95.75,38.7 | 83.54,37.42 83.54,35.17 82.54,35.17 C5.+ | HMMOD-UART.1 83.54,37.42 | CHPD1.2 64.26,39.64 64.48,39.64 v64.76,39.35 | v11.06,38.15 11.06,46.69 10.1,47.65 10.1,51.75 IC2.11 10.29,52.64 8.2,54.72 6.51,54.72 U$1.40
VIN
  Bottom 0.61: NO_FUSE.2 14.55,24.77 14.3,24.51 F1.P$2 11.35,24.51 9.54,22.7 U$2.TIP
VIN2  (via drill 0.3 pad 0.61)
  Top 0.61: v17.92,18.49 16.73,17.3 v13.82,17.3 | DBG.1 95.81,40.64 88.14,48.31 50.58,48.31 U$1.21
  Bottom 0.61: 28.5,21.7 28.9,21.7 35.31,28.11 35.31,29.67 35.5,29.86 35.5,38.7 35.3,38.89 35.3,39.83 35.5,40.02 35.5,50.67 36.23,51.4 47.48,51.4 U$1.21 | JP1.1 9.35,9.14 9.35,12.83 v13.82,17.3 | 19.59,20.57 19.59,20.17 v17.92,18.49 | 19.59,20.57 19.47,20.69 19.47,20.93 NO_REGULATOR.1 | 19.59,20.57 20.73,20.57 IC6.2 23.88,20.57 25,21.7 28.5,21.7 | 28.5,21.7 IC6.TAB IC1.4
WIZ_CS
  Top 0.305: IC2.5 17.91,29.06 18.01,29.06 18.12,29.17 18.35,29.17 18.36,29.18 18.86,29.18 18.98,29.06 35.51,29.06 35.87,28.69 36.3,28.69 39.09,31.48 48.6,31.48 49.47,32.35 U$1.20
WIZ_RST  (via drill 0.3 pad 0.61)
  Top 0.305: v36.07,39.2 29.45,39.2 20.42,48.23 20.42,50.24 18.72,51.94 IC2.8
  Bottom 0.305: U$1.16 39.31,36.01 39.26,36.01 v36.07,39.2

### Text on the board
tNames: MAPLE CUN / - large - | GND | CS | VCC | GND | T | GND | R | R | VCC | T | + | GND | VIN | TX | TX | RX | RX | 31 | VCC | LAN | C7 | Ant3 | Ant1 | Ant2 | Ant4
bNames: WLAN from Seeedstudio... | Socket CC1101 / TRX. 3 | Fuse | Version 3.4b / www.neuby.de | MAPLE CUN | Ant1 | Ant3 | Ant4 | Ant2